# EasyEDA schematic PCB_Schematic_Smart Home.json
TITLE: Smart Home 4ch; REV: 1.0; Date: 2020-07-02; Sheet: 1/1; Drawn By: AdithyaM; Company: Own
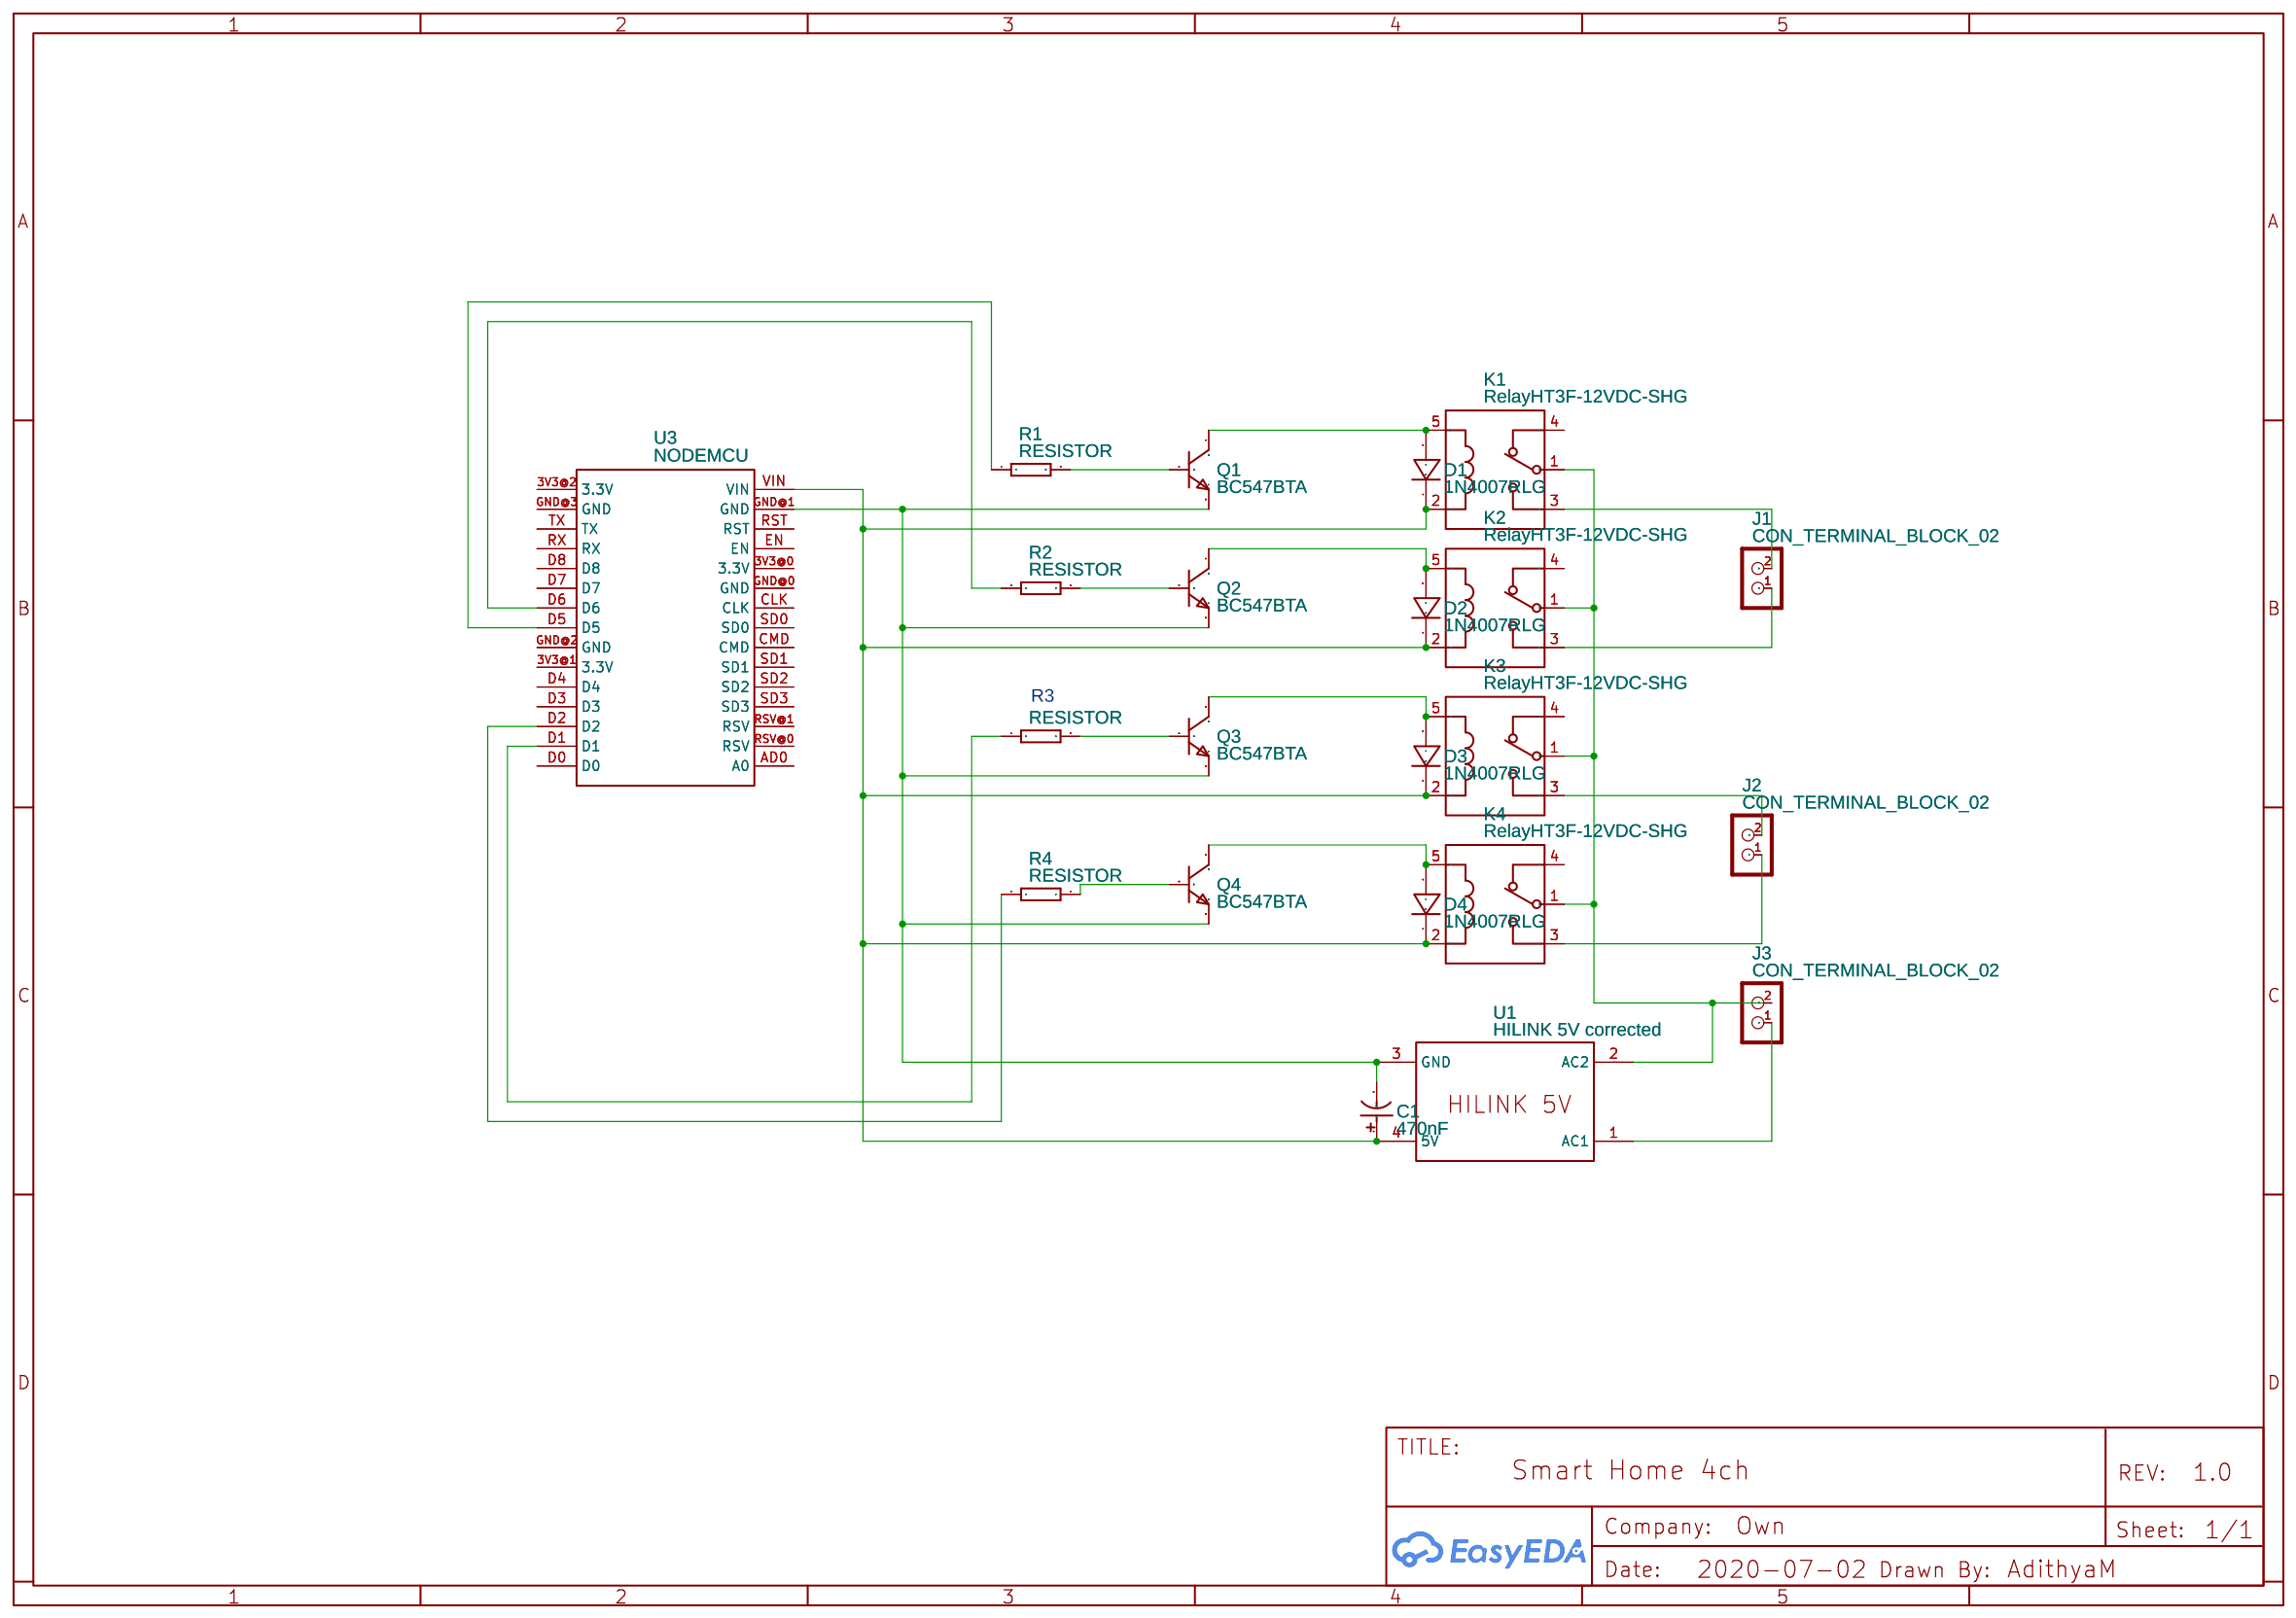
[diagram p0: schematic sheet]

## Parts
C1  470nF  [CAP-D4.0MZ]
D1  1N4007RLG  [DO-41_BD2.4-L4.7-P8.70-D0.9-RD]
D2  1N4007RLG  [DO-41_BD2.4-L4.7-P8.70-D0.9-RD]
D3  1N4007RLG  [DO-41_BD2.4-L4.7-P8.70-D0.9-RD]
D4  1N4007RLG  [DO-41_BD2.4-L4.7-P8.70-D0.9-RD]
J1  CON_TERMINAL_BLOCK_02  [TERMINAL_BLOCK_2P_5]
J2  CON_TERMINAL_BLOCK_02  [TERMINAL_BLOCK_2P_5]
J3  CON_TERMINAL_BLOCK_02  [TERMINAL_BLOCK_2P_5]
K1  RelayHT3F-12VDC-SHG  [RELAY-TH_HT3F-DCXX-X/X]
K2  RelayHT3F-12VDC-SHG  [RELAY-TH_HT3F-DCXX-X/X]
K3  RelayHT3F-12VDC-SHG  [RELAY-TH_HT3F-DCXX-X/X]
K4  RelayHT3F-12VDC-SHG  [RELAY-TH_HT3F-DCXX-X/X]
Q1  BC547BTA  [TO-92-3_L4.8-W3.7-P2.54-L]
Q2  BC547BTA  [TO-92-3_L4.8-W3.7-P2.54-L]
Q3  BC547BTA  [TO-92-3_L4.8-W3.7-P2.54-L]
Q4  BC547BTA  [TO-92-3_L4.8-W3.7-P2.54-L]
R1  RESISTOR  [RTH025W]
R2  RESISTOR  [RTH025W]
R3  RESISTOR  [RTH025W]
R4  RESISTOR  [RTH025W]
U1  HILINK 5V corrected  [FP_HILINK_5V_1A]
U3  NODEMCU  [ESP12E_DEVKIT]

## Library data of the parts
C1 = 0.47uF_50V_mz: Supplier: LCSC; Manufacturer: ValuePro; Manufacturer Part: 0.47uF 50V 4*5; Contributor: picam; Supplier Part: C45095
D1-D4 = 1N4007RLG: Supplier: LCSC; Manufacturer: ON; image: //image.lceda.cn/szlcsc/C53568.jpg; Supplier Part: C53568
J1-J3 = CON_TERMINAL_BLOCK_02: Contributor: DangerousPrototype
K1-K4 = RelayHT3F-12VDC-SHG: Supplier: LCSC; Manufacturer: HTV; image: //image.lceda.cn/szlcsc/C22022.jpg; Supplier Part: C22022
Q1-Q4 = BC547BTA: Supplier: LCSC; Supplier Part: C258144; Manufacturer: ON Semicon; Contributor: edyl36
R1-R4 = RESISTOR: Contributor: DangerousPrototype
U1 = HILINK 5V corrected: Manufacturer Part: HILINK 5V; Contributor: bruno.cadet
U3 = NODEMCU: Contributor: bhuvi

## Nets
Net-(C1-1): C1.1 D1.1(C) D2.1(C) D3.1(C) D4.1(C) K1.2 K2.2 K3.2 K4.2 U1.4(5V) U3.VIN
Net-(C1-2): C1.2 Q1.3(E) Q2.3(E) Q3.3(E) Q4.3(E) U1.3(GND) U3.GND@1(GND)
Net-(D1-2): D1.2(A) K1.5 Q1.1(C)
Net-(D2-2): D2.2(A) K2.5 Q2.1(C)
Net-(D3-2): D3.2(A) K3.5 Q3.1(C)
Net-(D4-2): D4.2(A) K4.5 Q4.1(C)
Net-(J1-1): J1.1 K2.3
Net-(J1-2): J1.2 K1.3
Net-(J2-1): J2.1 K4.3
Net-(J2-2): J2.2 K3.3
Net-(J3-1): J3.1 U1.1(AC1)
Net-(J3-2): J3.2 K1.1 K2.1 K3.1 K4.1 U1.2(AC2)
Net-(Q1-2): Q1.2(B) R1.2
Net-(Q2-2): Q2.2(B) R2.2
Net-(Q3-2): Q3.2(B) R3.2
Net-(Q4-2): Q4.2(B) R4.2
Net-(R1-1): R1.1 U3.D5
Net-(R2-1): R2.1 U3.D6
Net-(R3-1): R3.1 U3.D1
Net-(R4-1): R4.1 U3.D2

Not connected (* = marked no-connect by the designer): K1 4; K2 4; K3 4; K4 4; U3 3V3@0(3.3V) 3V3@1(3.3V) 3V3@2(3.3V) AD0(A0) CLK CMD D0 D3 D4 D7 D8 EN GND@0(GND) GND@2(GND) GND@3(GND) RST RSV@0(RSV) RSV@1(RSV) RX SD0 SD1 SD2 SD3 TX

## Notes on the sheet
- R3
